# EAGLE design SOT23-6-normal (EAGLE 6.5.0)
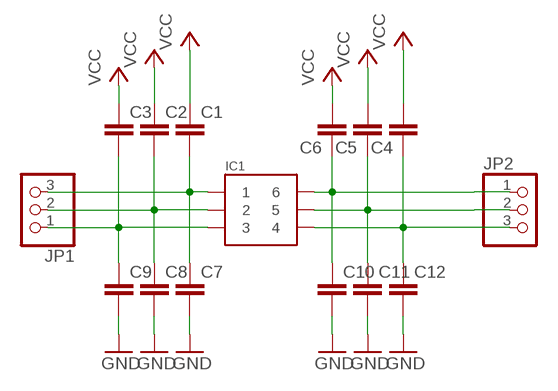
[diagram p0: schematic, sheet 1]

## Parts
C1  C-EUC0805  [C0805]
C2  C-EUC0805  [C0805]
C3  C-EUC0805  [C0805]
C4  C-EUC0805  [C0805]
C5  C-EUC0805  [C0805]
C6  C-EUC0805  [C0805]
C7  C-EUC0603  [C0603]
C8  C-EUC0603  [C0603]
C9  C-EUC0603  [C0603]
C10  C-EUC0603  [C0603]
C11  C-EUC0603  [C0603]
C12  C-EUC0603  [C0603]
IC1  2X3-PIN-SOT23  [SOT23-6]
JP1  PINHD-1X3  [1X03]
JP2  PINHD-1X3  [1X03]

## Nets
1: C1.2 C7.1 IC1.P$1 JP1.3
2: C2.2 C8.1 IC1.P$2 JP1.2
3: C3.2 C9.1 IC1.P$3 JP1.1
4: C4.1 C12.1 IC1.P$4 JP2.3
5: C5.1 C11.1 IC1.P$5 JP2.2
6: C6.1 C10.1 IC1.P$6 JP2.1
GND: C7.2 C8.2 C9.2 C10.2 C11.2 C12.2
VCC: C1.1 C2.1 C3.1 C4.2 C5.2 C6.2

## Library data of the parts
C1-C12 = p.peter-rcl:C-EU: CAPACITOR, European symbol
IC1 = p.peter-pacakages:2X3-PIN
JP1 JP2 = pinhead:PINHD-1X3: PIN HEADER

## Board
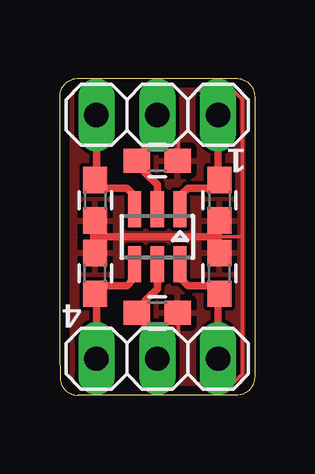
[diagram p1: board, top side]
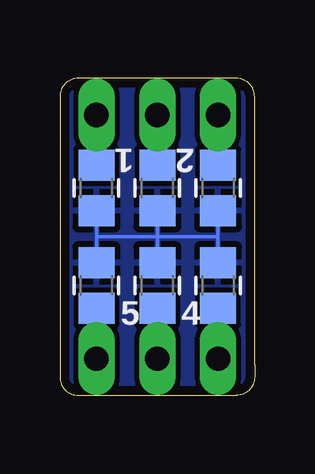
[diagram p2: board, bottom side, seen from below]

Size 8.13 x 13.21 mm. Coordinates in mm from the lower left corner, seen from the top.
Outline: 0,1.27 0,11.94 0,12.45 arc-90 0.76,13.21 1.27,13.21 6.86,13.21 7.11,13.21 7.37,13.21 arc-90 8.13,12.45 8.13,11.94 8.13,11.56 8.13,1.27 8.13,0.76 arc-90 7.37,0 6.86,0 1.27,0 0.76,0 arc-90 0,0.76 0,1.27
Copper layers (1*16): Top 0.0356mm / dielectric 1.5011mm / Bottom 0.0356mm
Design rules "oshpark": minimum track width 6mil, minimum drill 13mil, track to track 6mil, track to pad 6mil, pad to pad 6mil, via to via 6mil, smd to smd 6mil, copper to edge 15mil, drill to drill 6mil, minimum pad ring 7mil, minimum via ring 7mil, stop-mask expansion 4mil, vias tented up to drill 4.1mm, thermal gap 10mil

### Footprints (pad centres in the part's own frame; a part is rotated, then mirrored left to right if it is on the bottom)
C0805 = smd 1.3 x 1.5: 1 -0.95,0; 2 0.95,0
C0603 = smd 1.1 x 1: 1 -0.85,0; 2 0.85,0
SOT23-6 = smd 0.55 x 1.5: P$1 -0.95,-1.15; P$2 0,-1.15; P$3 0.95,-1.15; P$4 0.95,1.15; P$5 0,1.15; P$6 -0.95,1.15
1X03 = drill 1.016 long: 1 -2.54,0; 2 0,0; 3 2.54,0

### Placement (x,y rotation side)
C1  6.6,8.64 90 bottom
C2  4.06,8.64 90 bottom
C3  1.52,8.64 90 bottom
C4  1.52,4.57 90 bottom
C5  4.06,4.57 90 bottom
C6  6.6,4.57 90 bottom
C7  6.65,8.13 270 top
C8  4.06,9.78 0 top
C9  1.47,8.13 270 top
C10  6.65,5.08 90 top
C11  4.06,3.43 0 top
C12  1.47,5.08 90 top
IC1  4.06,6.6 180 top
JP1  4.06,11.68 0 top
JP2  4.06,1.52 180 top

### Tracks (layer width: path | path; a pad name or v marks a point on that pad's centre or on a via)
1
  Top 0.305: JP1.3 6.6,9.02 C7.1 6.57,8.64 5.33,8.64 5.08,8.38 5.01,8.32 IC1.P$1
  Bottom 0.813: JP1.3 C1.2
2
  Top 0.305: IC1.P$2 4.06,8.76 3.56,9.27 3.56,9.78 | 3.56,9.78 3.56,10.29 4.06,10.79 JP1.2 | C8.1 3.56,9.78
  Bottom 0.813: JP1.2 C2.2
3
  Top 0.305: JP1.1 1.52,9.02 1.48,8.98 C9.1 1.69,8.64 2.79,8.64 2.99,8.44 3.05,8.38 3.05,7.75 IC1.P$3
  Bottom 0.813: JP1.1 C3.2
4
  Top 0.305: IC1.P$4 3.05,5.45 3.05,4.95 3.05,4.83 2.79,4.57 2.54,4.57 1.81,4.57 C12.1 1.48,4.23 1.52,4.19 JP2.3
  Bottom 0.813: JP2.3 C4.1
5
  Top 0.305: IC1.P$5 4.06,4.45 3.68,4.06 3.56,3.94 3.56,3.43 | 3.56,3.43 3.56,2.92 4.06,2.41 JP2.2 | C11.1 3.56,3.43
  Bottom 0.813: JP2.2 C5.1
6
  Top 0.305: JP2.1 6.6,4.19 C10.1 6.57,4.57 5.33,4.57 5.08,4.83 5.08,4.95 5.01,5.02 IC1.P$6
  Bottom 0.813: JP2.1 C6.1
GND
  Top 0.152: C11.2 4.95,3.43 4.95,2.54 5.33,2.16 5.33,0.89 5.71,0.51 7.24,0.51 7.62,0.89 7.62,2.92 7.62,3.3 7.62,6.6 | 7.62,6.6 7.62,12.32 7.24,12.7 5.71,12.7 5.33,12.32 5.33,11.05 4.95,10.67 4.95,9.82 C8.2 | 7.62,6.6 6.6,6.6
  Top 0.305: 1.4,6.99 1.4,7.24 1.44,7.28 C9.2 1.47,7.06 1.4,6.99 | 1.4,6.99 1.4,6.6 | 1.4,6.6 1.4,6.01 C12.2 | C7.2 6.6,7.24 6.6,6.6 | 6.6,6.6 6.6,5.98 C10.2 | 1.4,6.99 1.4,6.6 | 1.4,6.6 6.6,6.6
  pour Top (isolate 0.152): -0.25,-0.25 -0.25,13.46 8.38,13.46 8.38,-0.25
VCC
  Bottom 0.152: C6.2 6.6,6.6 | C1.1 6.6,6.6 | 6.6,6.6 4.06,6.6 | 4.06,6.6 1.52,6.6 | C5.2 4.06,6.6 | C2.1 4.06,6.6 | C4.2 1.52,6.6 | C3.1 1.52,6.6
  pour Bottom (isolate 0.203): -0.25,-0.25 -0.25,13.46 8.38,13.46 8.38,-0.25

### Text on the board
tPlace: 1 | 4
bPlace: 2 | 1 | 4 | 5